# Altium schematic sheet sch2_eFuse_5V.SchDoc
size A4
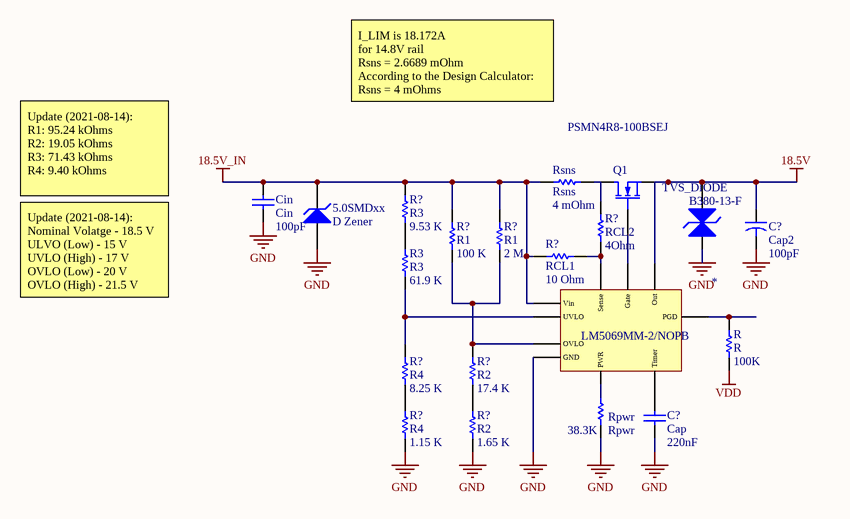
[diagram p0: sch2_eFuse_5V.SchDoc]

## Parts
(Parts that share a designator on the sheet are numbered #1, #2 ... from top to bottom, then left to right.)
5.0SMDxx  D Zener  [DIODE-0.7]
*  LM5069MM-2/NOPB  [TSSOP50P490X110-10N]
B380-13-F  TVS_DIODE  [SMBJ54A-13-F]
C?#1  Cap2  value 100pF  [CAPR5-4X5]
C?#2  Cap  value 220nF  [RAD-0.3]
Cin  Cin  value 100pF  [RAD-0.3]
Q1  PSMN4R8-100BSEJ  [DPAK254P1420X457-3N]
R  R  value 100K  [RESC1608X06N_0603]
R3  R3  value 61.9 K  [RESC1608X06N_0603]
R?#1  R3  value 9.53 K  [RESC1608X06N_0603]
R?#2  RCL1  value 10 Ohm  [RESC1608X06N_0603]
R?#3  RCL2  value 4Ohm  [RESC1608X06N_0603]
R?#4  R1  value 100 K  [RESC1608X06N_0603]
R?#5  R1  value 2 M  [RESC1608X06N_0603]
R?#6  R4  value 8.25 K  [RESC1608X06N_0603]
R?#7  R2  value 17.4 K  [RESC1608X06N_0603]
R?#8  R4  value 1.15 K  [RESC1608X06N_0603]
R?#9  R2  value 1.65 K  [RESC1608X06N_0603]
Rpwr  Rpwr  value 38.3K  [RESC1608X06N_0603]
Rsns  Rsns  value 4 mOhm  [RESC1608X06N_0603]

## Nets
18.5V: *.9(Out) B380-13-F.2(K) C?#1.1 Q1.3(S)
18.5V_IN: 5.0SMDxx.2(K) *.2(Vin) Cin.2 R?#1.2 R?#2.1 R?#4.2 R?#5.2 Rsns.1
GND: 5.0SMDxx.1(A) *.5(GND) B380-13-F.1(A) C?#1.2 C?#2.1 Cin.1 R?#8.2 R?#9.1 Rpwr.1
VDD: R.1
Net*_1: *.1(Sense) R?#2.2 R?#3.1
Net*_3: *.3(UVLO) R3.1 R?#6.1
Net*_4: *.4(OVLO) R?#4.1 R?#5.1 R?#7.1
Net*_6: *.6(Timer) C?#2.2
Net*_7: *.7(PWR) Rpwr.2
Net*_8: *.8(PGD) R.2
Net*_10: *.10(Gate) Q1.1(G)
NetR3_2: R3.2 R?#1.1
NetR?#3_2: R?#3.2 Rsns.2
NetR?#6_2: R?#6.2 R?#8.1
NetR?#7_2: R?#7.2 R?#9.2

Not connected (* = marked no-connect by the designer): Q1 2(D)

## Notes on the sheet
- I_LIM is 18.172A
  for 14.8V rail
  Rsns = 2.6689 mOhm                            According to the Design Calculator: Rsns = 4 mOhms
- Design for 20A sustained @ 16.8V
- Update (2021-08-14):
  R1: 95.24 kOhms
  R2: 19.05 kOhms                     R3: 71.43 kOhms                                 R4: 9.40 kOhms
- Update (2021-08-14): Nominal Volatge - 18.5 V ULVO (Low) - 15 V UVLO (High) - 17 V OVLO (Low) - 20 V OVLO (High) - 21.5 V
- UVLO (L)= 12V
  UVLO (H) = 14V
  OVLO (H) = 17.5V
  OVLO (L) = 16.8V

## Library data of the parts
5.0SMDxx = D Zener: Zener Diode; Published: 8-Jun-2000; LatestRevisionDate: 17-Jul-2002; LatestRevisionNote: Re-released for DXP Platform.; PackageReference: DIODE-0.7; Publisher: Altium Limited; PackageDescription: Diode, Thru-Hole; 2 Leads; 0.7 in Pin Spacing
* = LM5069MM-2/NOPB: Hot Swap Controller 1-CH 80V N-Channel Positive High Voltage 10-Pin VSSOP T/R; Manufacturer 1: TI National Semiconductor; Min Supply Voltage: 9V; Number of Channels: 1; Output Voltage: 12V; Supplier 1: Digi-Key; Manufacturer Part Number 1: LM5069MM-2/NOPB; Stock 1: 115715; Pricing 1: 1=3.00000, 10=2.69700, 25=2.54920, 100=2.09610, 250=1.88080, 500=1.81280 (USD); RoHS: Yes; Mount: Surface Mount; Case/Package: MSOP; Number of Pins: 10; Min Operating Temperature: -40°C; Max Operating Temperature: 125°C; Packaging: Tape and Reel; Package Quantity: 1000; Max Supply Voltage: 80V; Number of Outputs: 1; Length: 3mm; Height: 0.86mm; Depth: 3.1mm; Width: 3mm; Radiation Hardening: No; Lead Free: Lead Free; REACH SVHC: No SVHC; ComponentLink1URL: https://datasheet.ciiva.com/15099/getdatasheetpartid-628880-15099677.pdf?src-supplier=Verical; ComponentLink1Description: https://datasheet.ciiva.com/15099/getdatasheetpartid-628880-15099677.pdf?src-supplier=Verical; ComponentLink2URL: https://datasheet.ciiva.com/3222/lm5069-3222438.pdf?src-supplier=Avnet; ComponentLink2Description: https://datasheet.ciiva.com/3222/lm5069-3222438.pdf?src-supplier=Avnet; ComponentLink3URL: https://datasheet.ciiva.com/3222/lm5069-3222470.pdf?src-supplier=Avnet; ComponentLink3Description: https://datasheet.ciiva.com/3222/lm5069-3222470.pdf?src-supplier=Avnet; ComponentLink4URL: https://datasheet.ciiva.com/6609/lm5069-6609670.pdf?src-supplier=Digi-Key; ComponentLink4Description: https://datasheet.ciiva.com/6609/lm5069-6609670.pdf?src-supplier=Digi-Key; ComponentLink5URL: https://datasheet.ciiva.com/1511/1642228-1511437.pdf?src-supplier=Element14; ComponentLink5Description: https://datasheet.ciiva.com/1511/1642228-1511437.pdf?src-supplier=Element14; Supplier Part Number 1: LM5069MM-2/NOPBCT-ND
B380-13-F = TVS_DIODE: TVS Diode; Published: 8-Jun-2000; LatestRevisionDate: 17-Jul-2002; LatestRevisionNote: Re-released for DXP Platform.; PackageVersion: Sep-1996; PackageReference: SMC; Publisher: Altium Limited; PackageDescription: DO-214-AB/SMC; 2 C-Bend Leads; Body 7.9 x 5.9 mm, inc. leads (LxW); Code_JEDEC: DO-214-AB
C?#1 = Cap2: Capacitor; Published: 23-Sep-2002; PackageReference: CAPR5-4X5; Publisher: Altium Limited; PackageDescription: Capacitor; 2 Leads
C?#2 Cin = Cap: Capacitor; Published: 8-Jun-2000; LatestRevisionDate: 17-Jul-2002; LatestRevisionNote: Re-released for DXP Platform.; PackageReference: RAD-0.3; Publisher: Altium Limited; PackageDescription: Radial Cap, Thru-Hole; 2 Leads; 0.3 in Pin Spacing
Q1 = PSMN4R8-100BSEJ: N-Channel MOSFET; Published: 8-Jun-2000; LatestRevisionDate: 17-Jul-2002; LatestRevisionNote: Re-released for DXP Platform.; PackageVersion: 1995/1996; PackageReference: E3; Publisher: Altium Limited; PackageDescription: TO, Flat Index; 3 In-Line, Axial Leads; Body Dia. 4.6mm; Lead Dia. 0.5 mm (max); Supplier 1: Digi-Key; Supplier Part Number 1: 1727-1103-1-ND
R R3 R?#1-R?#9 Rpwr Rsns = Res1: Resistor; Published: 8-Jun-2000; LatestRevisionDate: 17-Jul-2002; LatestRevisionNote: Re-released for DXP Platform.; PackageReference: AXIAL-0.3; Publisher: Altium Limited; PackageDescription: Axial Device, Thru-Hole; 2 Leads; 0.3 in Pin Spacing